# EAGLE design FTDI Basic-v21-5V (EAGLE 6.3)
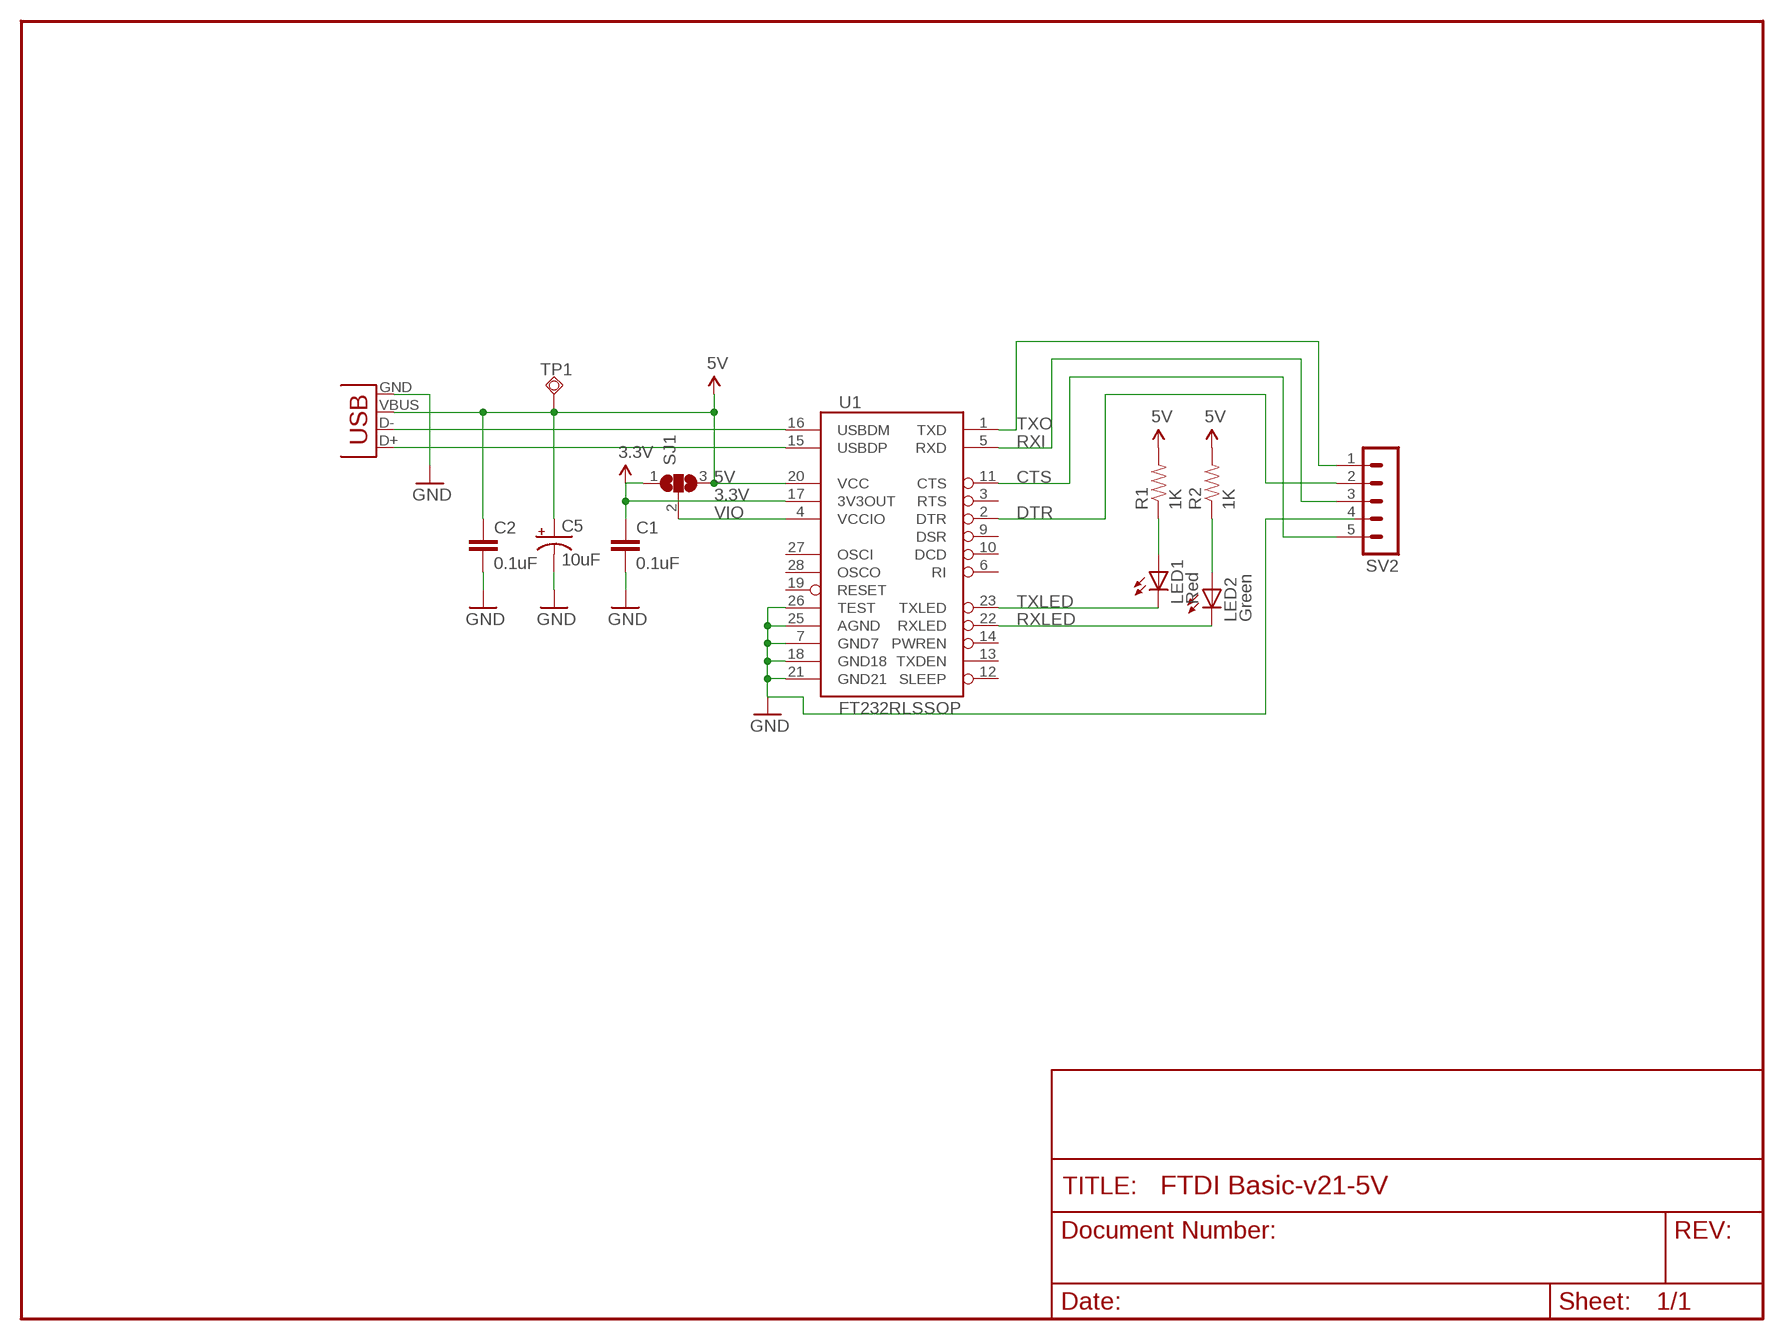
[diagram p0: schematic, sheet 1]

## Parts
C1  0.1uF  CAP0402-CAP  [0402-CAP]
C2  0.1uF  CAP0402-CAP  [0402-CAP]
C5  10uF  CAP_POL1206  [EIA3216]
LED1  Red  LED0603  [LED-0603]
LED2  Green  LED0603  [LED-0603]
R1  1K  RESISTOR0402-RES  [0402-RES]
R2  1K  RESISTOR0402-RES  [0402-RES]
SJ1  SJ2W  [SJ_2]
SV2  MA05-1  [MA05-1]
TP1  TPSQPAD1-13  [P1-13]
U1  FT232RLSSOP  [SSOP28DB]
X2  USBPTH  [USB-B-PTH]

## Nets
3.3V [power]: C1.1 SJ1.1 U1.17(3V3OUT)
5V: C2.1 C5.A(+) R1.2 R2.2 SJ1.3 TP1.TP U1.20(VCC) X2.VBUS
CTS: SV2.5 U1.11(CTS)
DTR: SV2.2 U1.2(DTR)
GND [power]: C1.2 C2.2 C5.C(-) SV2.4 U1.7(GND7) U1.18(GND18) U1.21(GND21) U1.25(AGND) U1.26(TEST) X2.GND
N$1: LED1.A R1.1
N$2: LED2.A R2.1
RXI: SV2.3 U1.5(RXD)
RXLED: LED2.C U1.22(RXLED)
TXLED: LED1.C U1.23(TXLED)
TXO: SV2.1 U1.1(TXD)
USB_D+: U1.15(USBDP) X2.D+
USB_D-: U1.16(USBDM) X2.D-
VIO [power]: SJ1.2 U1.4(VCCIO)
Unconnected: U1.3(RTS) U1.6(RI) U1.9(DSR) U1.10(DCD) U1.12(SLEEP) U1.13(TXDEN) U1.14(PWREN) U1.19(RESET) U1.27(OSCI) U1.28(OSCO)

## Library data of the parts
C1 C2 = SparkFun:CAP: Capacitor Standard 0603 ceramic capacitor, and 0.1" leaded capacitor.
C5 = SparkFun:CAP_POL: Capacitor Polarized These are standard SMD and PTH capacitors. Normally 10uF, 47uF, and 100uF in electrolytic and tantalum varieties. Always verify the external diameter of the through hole cap, it varies with capacity, voltage, and manufacturer. The EIA devices should be standard.
LED1 LED2 = SparkFun:LED: LEDs Standard schematic elements and footprints for 5mm, 3mm, 1206, and 0603 sized LEDs. 5mm - Spark Fun Electronics SKU : COM-00529 (and others)
R1 R2 = SparkFun:RESISTOR: Resistor Basic schematic elements and footprints for 0603, 1206, and PTH resistors.
SJ1 = jumper:SJ2W: SMD solder JUMPER
SV2 = con-lstb:MA05-1: PIN HEADER; OC_FARNELL: unknown; OC_NEWARK: unknown
TP1 = testpad:TPSQ: Test pad
U1 = SparkFun:FT232RL: USB UART FT232RL 4th Generation USB UART (USB <-> Serial) Controller. Spark Fun Electronics SKU : COM-00650
X2 = SparkFun:USB: USB Connectors USB-B-PTH is fully proven SKU : PRT-00139 USB-miniB is fully proven SKU : PRT-00587 USB-A-PCB is untested. USB-A-H is throughly reviewed, but untested. Spark Fun Electronics SKU : PRT-00437 USB-B-SMT is throughly reviewed, but untested. Needs silkscreen touching up. USB-A-S has not been used/tested USB-MB-H has not been used/tested

## Net classes
0 default: width 0.203 mm
1 power: width 0.254 mm

## Board
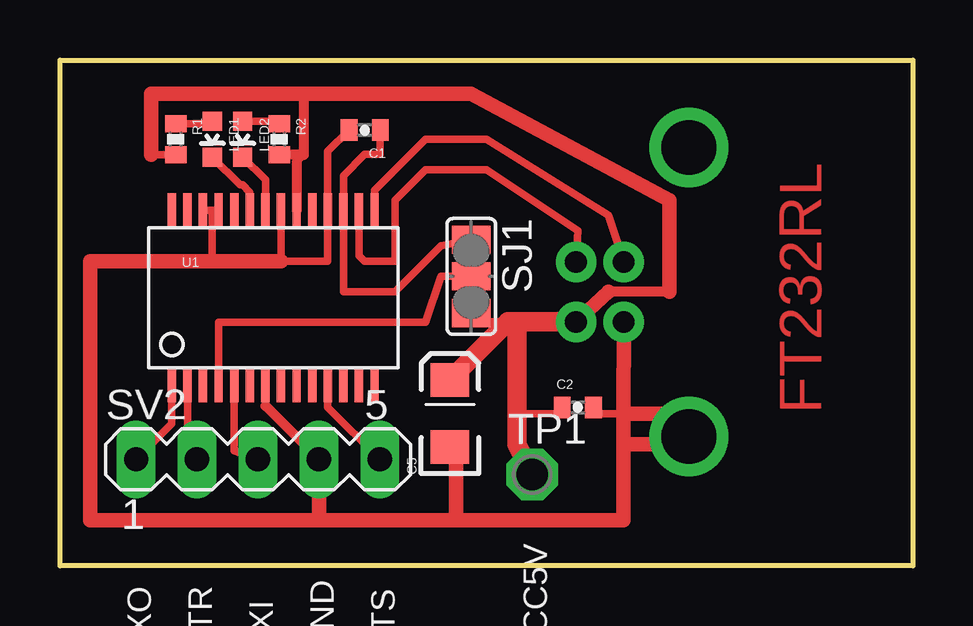
[diagram p1: board, top side]
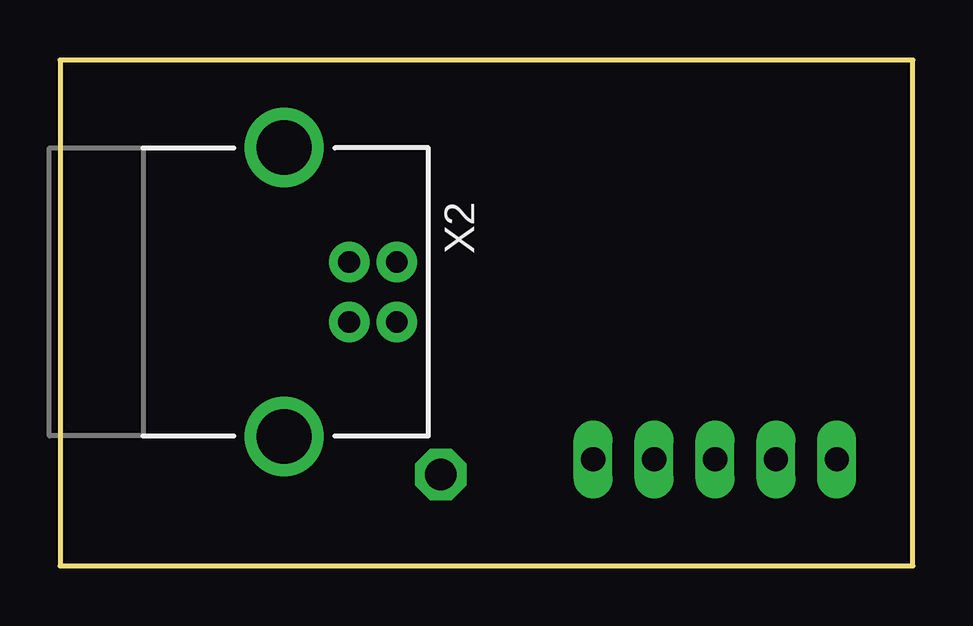
[diagram p2: board, bottom side, seen from below]

Size 35.56 x 21.08 mm. Coordinates in mm from the lower left corner, seen from the top.
Outline: 0,21.08 35.56,21.08 35.56,0 0,0 0,21.08
Copper layers (1*16): Top 0.035mm / dielectric 1.5mm / Bottom 0.035mm
Design rules "SparkFun *": minimum track width 8mil, minimum drill 20mil, track to track 8mil, track to pad 10mil, pad to pad 10mil, via to via 8mil, smd to smd 8mil, copper to edge 8mil, drill to drill 8mil, minimum pad ring 12mil, minimum via ring 10mil, stop-mask expansion 4mil, vias tented up to drill 20mil, thermal gap 10mil

### Footprints (pad centres in the part's own frame; a part is rotated, then mirrored left to right if it is on the bottom)
0402-CAP = smd 0.7 x 0.9: 1 -0.65,0; 2 0.65,0
EIA3216 = smd 1.4 x 1.6: A 1.4,0; C -1.4,0
LED-0603 = smd 0.8 x 0.8: A 0,-0.75; C 0,0.75
0402-RES = smd 0.7 x 0.9: 1 -0.65,0; 2 0.65,0
SJ_2 = smd 1.168 x 1.6: 1 -1.524,0; 2 0,0; 3 1.524,0
MA05-1 = drill 1.016 long: 1 -5.08,0; 2 -2.54,0; 3 0,0; 4 2.54,0; 5 5.08,0
P1-13 = drill 1.321 pad 2.159 octagon: TP 0,0
SSOP28DB = smd 0.348 x 1.397: 1 -4.225,-3.656; 2 -3.575,-3.656; 3 -2.925,-3.656; 4 -2.275,-3.656; 5 -1.625,-3.656; 6 -0.975,-3.656; 7 -0.325,-3.656; 8 0.325,-3.656; 9 0.975,-3.656; 10 1.625,-3.656; 11 2.275,-3.656; 12 2.925,-3.656; 13 3.575,-3.656; 14 4.225,-3.656; 15 4.225,3.656; 16 3.575,3.656; 17 2.925,3.656; 18 2.275,3.656; 19 1.625,3.656; 20 0.975,3.656; 21 0.325,3.656; 22 -0.325,3.656; 23 -0.975,3.656; 24 -1.625,3.656; 25 -2.275,3.656; 26 -2.925,3.656; 27 -3.575,3.656; 28 -4.225,3.656
USB-B-PTH = drill 0.914 pad 1.676 round: D+ 0,1.25; D- 1.981,1.25; GND 0,-1.25; VBUS 1.981,-1.25 | drill 2.286 round: P$1 -2.718,-6.02; P$2 -2.718,6.02

### Placement (x,y rotation side)
C1  12.7,18.16 180 top
C2  21.59,6.6 0 top
C5  16.26,6.35 90 top
LED1  6.35,17.78 180 top
LED2  7.62,17.78 180 top
R1  4.83,17.78 270 top
R2  9.14,17.78 270 top
SJ1  17.14,12.06 270 top
SV2  8.26,4.45 0 top
TP1  19.68,3.81 0 top
U1  8.89,11.18 0 top
X2  23.5,11.42 0 bottom

### Tracks (layer width: path | path; a pad name or v marks a point on that pad's centre or on a via)
3.3V
  Top 0.305: C1.1 13.35,17.14 12.7,17.14 11.82,16.26 U1.17 11.82,11.43 13.97,11.43 15.88,13.34 SJ1.1
5V
  Top 0.305: R1.2 3.81,17.13 | 10.16,17.13 9.87,16.84 | SJ1.3 17.14,10.17 19.05,10.17 | C2.1 20.94,6.35 19.05,6.35
  Top 0.406: R2.2 10.16,17.13 10.16,19.68 | 9.87,16.84 U1.20 | 25.4,11.43 22.86,11.43
  Top 0.61: 3.81,17.13 3.81,19.68 10.16,19.68 17.14,19.68 25.4,15.24 25.4,11.43 | 22.86,11.43 X2.VBUS
  Top 0.813: X2.VBUS 19.05,10.17 | 19.05,10.17 18.67,10.17 C5.A | 19.05,10.17 19.05,6.35 19.05,5.08 TP1.TP
CTS
  Top 0.305: U1.11 11.17,6.62 SV2.5
DTR
  Top 0.305: U1.2 5.31,4.68 SV2.2
GND
  Top 0.305: 16.51,4.95 C5.C | 6.35,12.7 6.35,14.83 | 6.35,14.83 U1.25 | 6.35,14.83 U1.26 | U1.21 9.21,12.7 11.17,12.7 U1.18 11.17,17.28 C1.2 | 8.57,6.67 U1.7 | C2.2 22.24,6.35 23.5,6.35
  Top 0.406: SV2.4 8.57,6.67 | 23.5,5.08 23.5,5.33
  Top 0.61: X2.GND 23.5,6.35 23.5,5.08 23.5,1.91 16.51,1.91 | 10.79,1.91 16.51,1.91 | 16.51,1.91 16.51,4.95 | 9.21,12.7 6.35,12.7 1.27,12.7 1.27,1.91 10.79,1.91 | 10.79,1.91 SV2.4
N$1
  Top 0.305: R1.1 6.25,18.43 LED1.A
N$2
  Top 0.305: LED2.A 9.04,18.53 R2.1
N$3
  Top 0.61: 26.67,6.35 23.5,6.35 23.5,5.71
N$4
  Top 0.61: 26.67,5.08 23.5,5.08 23.5,4.45
N$5  (via drill 1.5)
  other vias: 26.2,17.43
N$6  (via drill 1.5)
  other vias: 26.2,5.4
RXI
  Top 0.305: U1.5 7.27,4.8 SV2.3
RXLED
  Top 0.305: U1.22 8.57,16.09 LED2.C
TXLED
  Top 0.305: U1.23 7.92,15.58 7.62,15.88 7.51,15.88 LED1.C
TXO
  Top 0.305: U1.1 4.66,5.93 SV2.1
USB_D+
  Top 0.305: U1.15 13.12,15.65 15.24,17.78 17.78,17.78 22.86,14.61 X2.D+
USB_D-
  Top 0.305: U1.16 12.46,12.93 12.7,12.7 13.97,12.7 13.97,15.24 15.24,16.51 17.78,16.51 21.59,13.97 X2.D-
VIO
  Top 0.305: U1.4 6.62,10.16 15.24,10.16 15.88,12.06 SJ1.2

### Text on the board
Top: FT232RL
tNames: TXO | DTR | RXI | GND | CTS | VCC5V
tValues: Close